# Altium schematic sheet LineReceiver.SchDoc: EEROS: Adapter for NTB SCARA
size A4; Author: URSS; CompanyName: NTB; DrawnBy: Martin Zueger; Organization: NTB Interstate University of Applied; Address1: Werdenbergstrasse 4; Address3: 9471 Buchs; Address4: Switzerland; Revision: 0.1; SheetNumber: 2; SheetTotal: 3; Organization1: Sciences of Technology Buchs; Description: Line Receiver A,B and I with SN75175D; ProjectName: EEROS
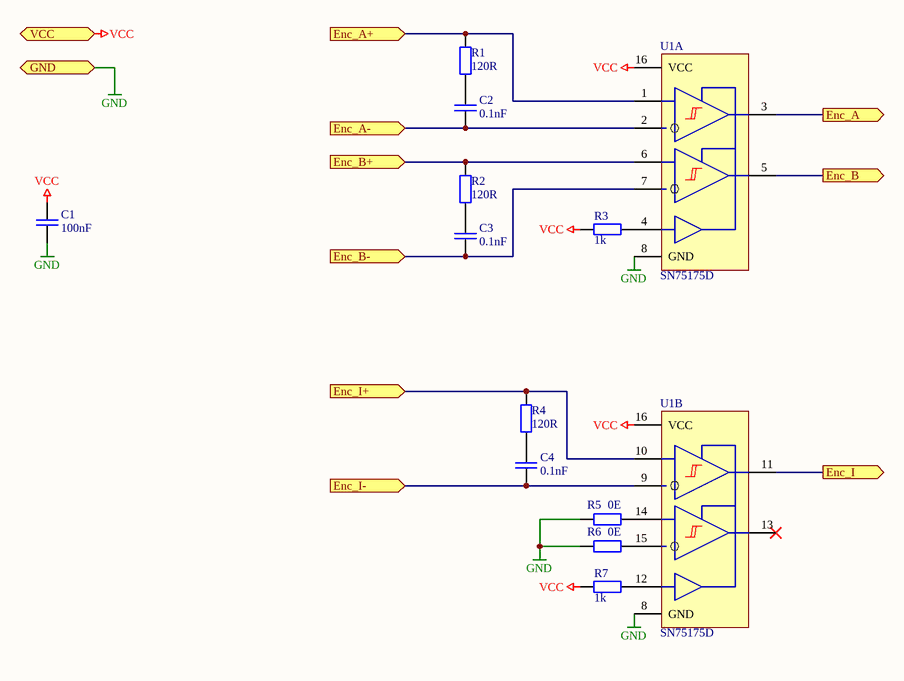
[diagram p0: LineReceiver.SchDoc]

## Parts
C1  100nF  [1206]
C2  0.1nF  [0805]
C3  0.1nF  [0805]
C4  0.1nF  [0805]
R1  120R  [0805]
R2  120R  [0805]
R3  1k  [0805]
R4  120R  [0805]
R5  0E  [0805]
R6  0E  [0805]
R7  1k  [0805]
U1  SN75175D  [SO16-M]  (parts A,B of 2)

## Ports
Enc_A (out), Enc_A+ (in), Enc_A- (in), Enc_B (out), Enc_B+ (in), Enc_B- (in), Enc_I (out), Enc_I+ (in), Enc_I- (in), GND, VCC (in)

## Nets
GND: C1.1 R5.2 R6.2 U1.8(GND) ; port GND
VCC: C1.2 R3.2 R7.2 U1.16(VCC) ; port VCC
Enc_A: U1.3 ; port Enc_A
Enc_A+: R1.2 U1.1 ; port Enc_A+
Enc_A-: C2.1 U1.2 ; port Enc_A-
Enc_B: U1.5 ; port Enc_B
Enc_B+: R2.2 U1.6 ; port Enc_B+
Enc_B-: C3.1 U1.7 ; port Enc_B-
Enc_I: U1.11 ; port Enc_I
Enc_I+: R4.2 U1.10 ; port Enc_I+
Enc_I-: C4.1 U1.9 ; port Enc_I-
NetC2_2: C2.2 R1.1
NetC3_2: C3.2 R2.1
NetC4_2: C4.2 R4.1
NetR3_1: R3.1 U1.4(EN)
NetR5_1: R5.1 U1.14
NetR6_1: R6.1 U1.15
NetR7_1: R7.1 U1.12

Not connected (* = marked no-connect by the designer): U1 13*

## Notes on the sheet
- Title:
- Description:
- Size:
- Date:
- Name:
- A4
- Number:
- Time:
- Revision:
- Sheet
- Checked:
- of
- File:

## Library data of the parts
C1-C4 = C: Capacitor; #Manufacturer: Generic Components; #Publisher: Dr. A. Heinzelmann; #Class: Passive; Initial Voltage: 0V; Voltage Maximum: ??? V; #Published: 2006-10-07; #ClassSub: Capacitor
  C1: Value: 100nF
  C2-C4: Value: 0.1nF
R1-R7 = R: Resistor; #Manufacturer: Generic Components; #Publisher: Dr. A. Heinzelmann; #Class: Passive; #Published: 2006-10-06; #ClassSub: Resistor
  R1 R2 R4: Value: 120R
  R3 R7: Value: 1k
  R5 R6: Value: 0E
U1 = SN75175D: TEXAS INSTRUMENTS - SN75175D - LINE RECEIVER,QUAD RS485/422/423; #Manufacturer: TI; #Class: Interface; OrderNr: 1103177; Published: 20121204; LatestRevisionDate: 20121204; LatestRevisionNote: create symbol and footprint; PackageReference: TI--R-PDSO-G16--SOIC16; Publisher: Stefan Ursella, M.Eng; #ClassSub: line receiver; ComponentLink1Description: Distributor; ComponentLink1URL: http://ch.farnell.com/texas-instruments/sn75175d/line-receiver-quad-rs485-422-423/dp/1103177; Distributor: Farnell; PackageDescription: SOIC16; Type: SN75175D